# Altium schematic sheet LEDS.schdoc
size 120 x 140 mm
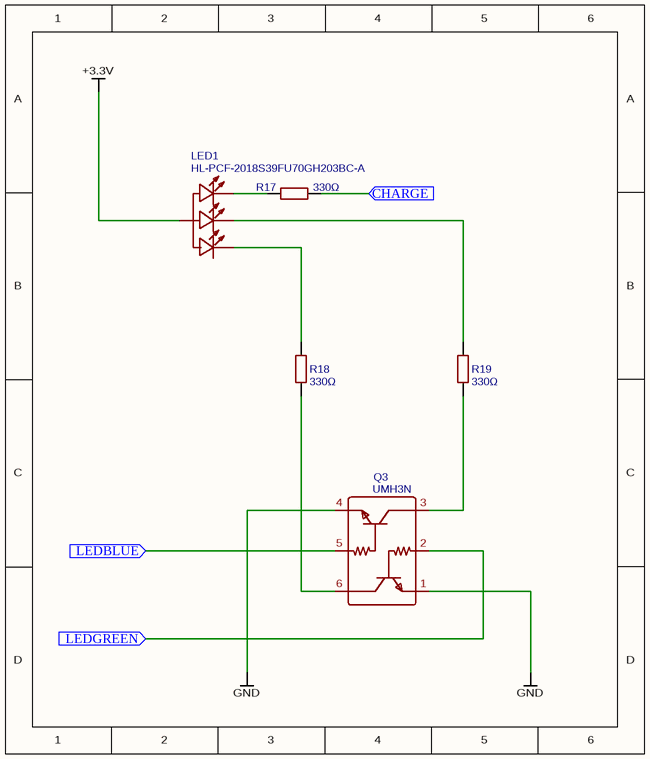
[diagram p0: LEDS.schdoc]

## Parts
LED1  HL-PCF-2018S39FU70GH203BC-A  [LED-ARRAY-SMD_4P-L2.0-W1.R8-TL]
Q3  UMH3N  [SC-70-6_L2.2-W1.3-P0.65-LS2.1-BR]
R17  330Ω  [R0603]
R18  330Ω  [R0603]
R19  330Ω  [R0603]

## Ports
CHARGE (in), LEDBLUE (in), LEDGREEN (in)

## Nets
+3.3V: LED1.2(A)
GND: Q3.1(E) Q3.4(E)
CHARGE: R17.1 ; port CHARGE
LEDBLUE: Q3.5(B) ; port LEDBLUE
LEDGREEN: Q3.2(B) ; port LEDGREEN
NetLED1_1: LED1.1(C) R18.2
NetLED1_3: LED1.3(C) R17.2
NetLED1_4: LED1.4(C) R19.2
NetQ3_3: Q3.3(C) R19.1
NetQ3_6: Q3.6(C) R18.1

## Library data of the parts
LED1 = HL-PCF-2018S39FU70GH203BC-A: BOM_Manufacturer: HONGLITRONIC(Hongli Zhihui (HONGLITRONIC)); Contributor: LCSC; BOM_Supplier: LCSC; BOM_Supplier Part: C513367; BOM_Manufacturer Part: HL-PCF-2018S39FU70GH203BC-A; spicePre: L; spiceSymbolName: HL-PCF-2018S39FU70GH203BC-A
Q3 = UMH3N: BOM_Manufacturer: CJ; BOM_Supplier: LCSC; BOM_Manufacturer Part: UMH3N; BOM_Supplier Part: C62892; BOM_JLCPCB Part Class: Extended Part; spicePre: Q; spiceSymbolName: UMH3N
R17-R19 = 330Ω: BOM_Manufacturer: FH; BOM_Manufacturer Part: RS-03K331FT; Resistance (Ohms): 330; nameAlias: Resistance; Contributor: LCSC; BOM_Supplier: LCSC; BOM_Supplier Part: C125768; BOM_JLCPCB Part Class: Extended Part; spicePre: R; spiceSymbolName: RS-03K331FT